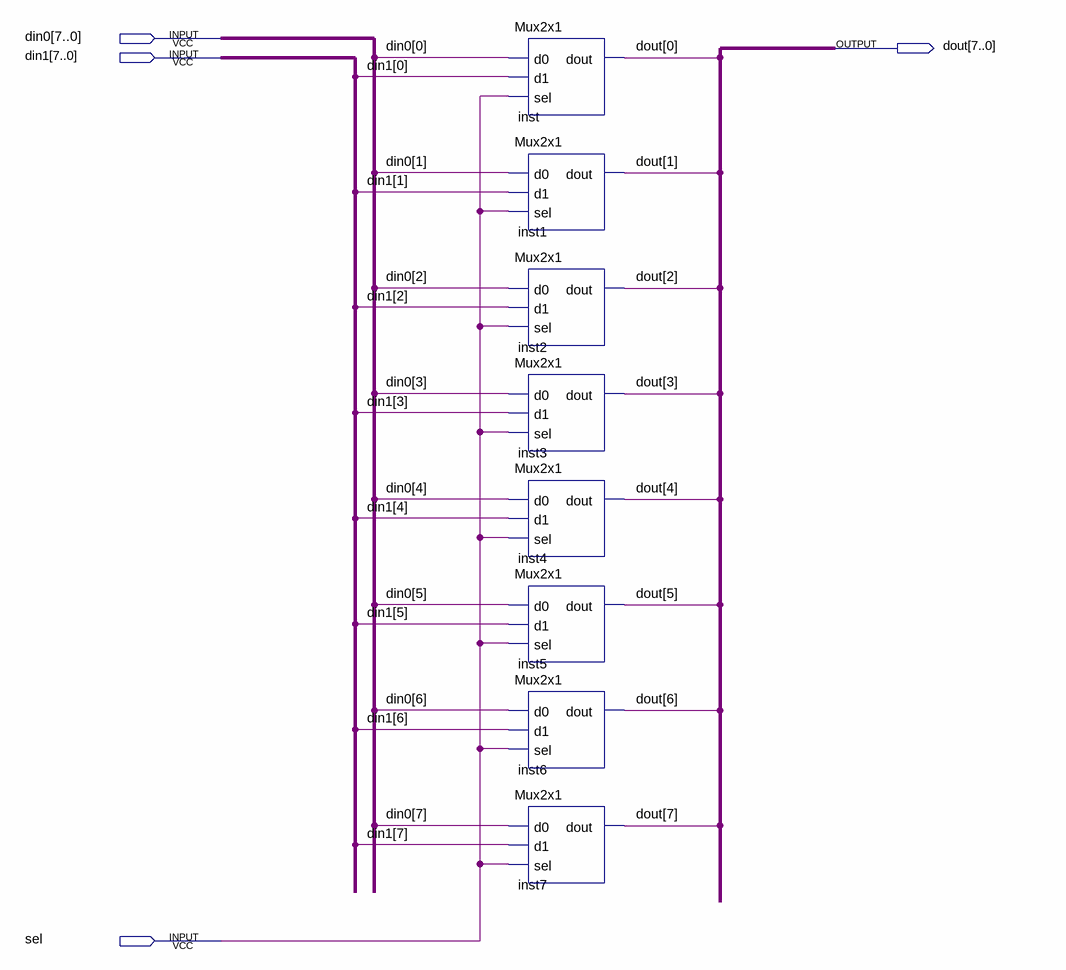
[diagram p0: schematic sheet]
// Quartus schematic Mux8bit2x1.bdf as structural Verilog: 8 symbols, 4 pins
module Mux8bit2x1 (
  input  [7:0] din0,
  input  [7:0] din1,
  input  sel,
  output [7:0] dout
);

  Mux2x1 inst (.d0(din0[0]), .d1(din1[0]), .sel(sel), .dout(dout[0]));
  Mux2x1 inst1 (.d0(din0[1]), .d1(din1[1]), .sel(sel), .dout(dout[1]));
  Mux2x1 inst2 (.d0(din0[2]), .d1(din1[2]), .sel(sel), .dout(dout[2]));
  Mux2x1 inst3 (.d0(din0[3]), .d1(din1[3]), .sel(sel), .dout(dout[3]));
  Mux2x1 inst4 (.d0(din0[4]), .d1(din1[4]), .sel(sel), .dout(dout[4]));
  Mux2x1 inst5 (.d0(din0[5]), .d1(din1[5]), .sel(sel), .dout(dout[5]));
  Mux2x1 inst6 (.d0(din0[6]), .d1(din1[6]), .sel(sel), .dout(dout[6]));
  Mux2x1 inst7 (.d0(din0[7]), .d1(din1[7]), .sel(sel), .dout(dout[7]));
endmodule
